# Altium schematic sheet Transmissor Ignitor.SchDoc
size A4
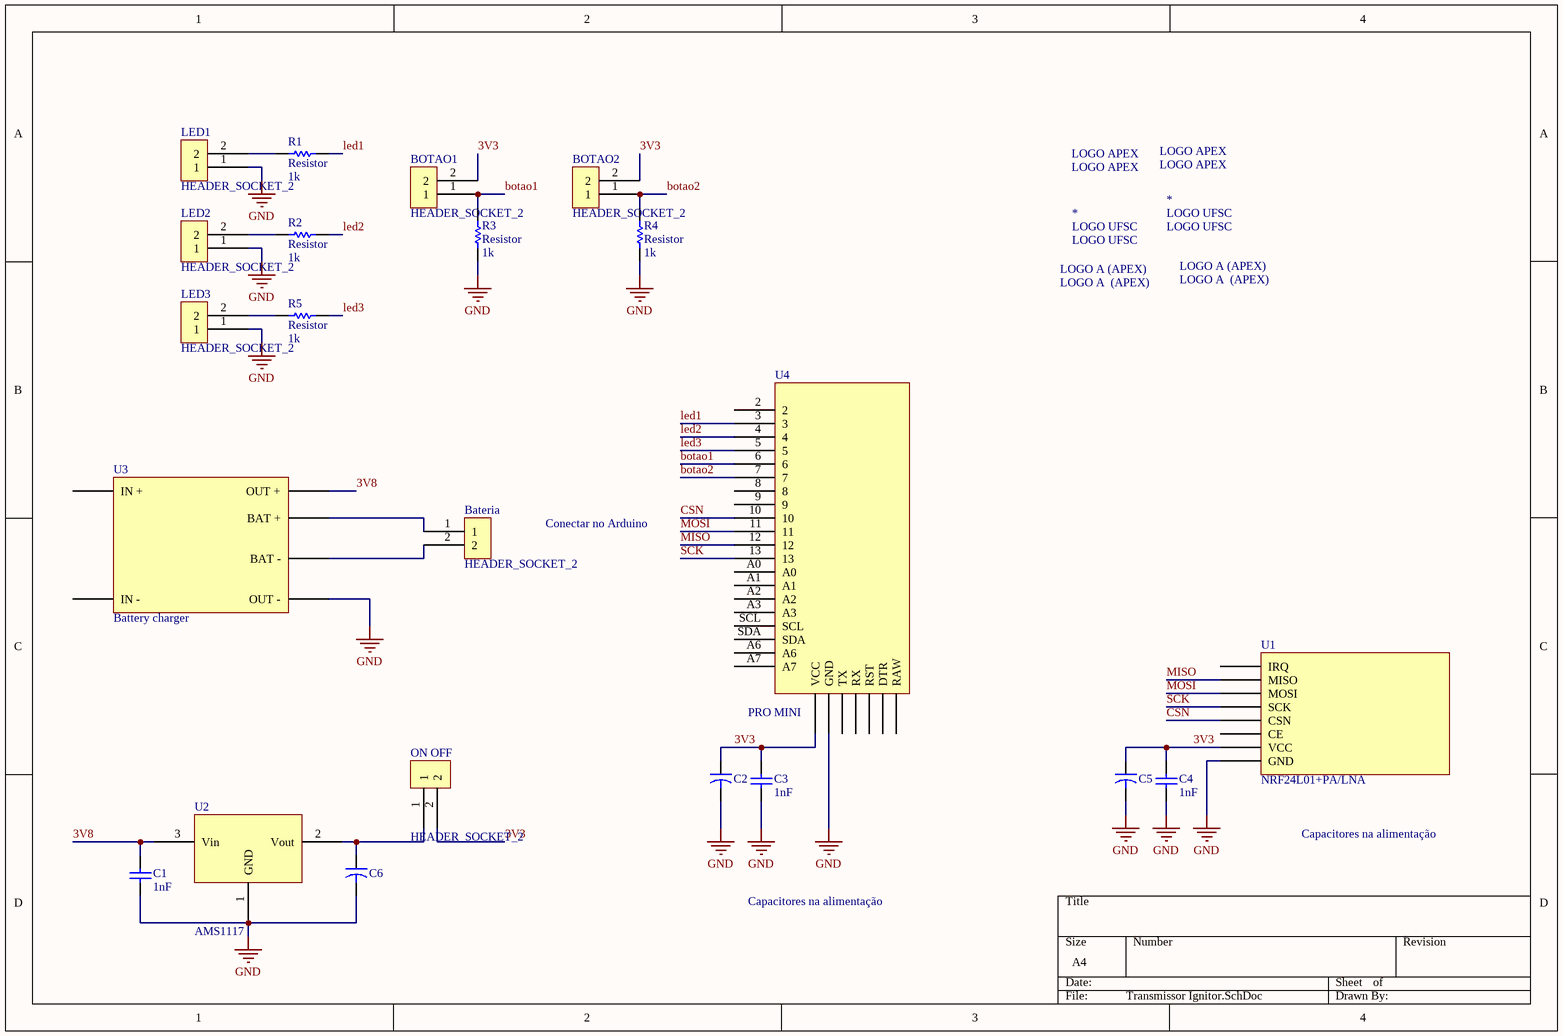
[diagram p0: Transmissor Ignitor.SchDoc]

## Parts
(Parts that share a designator on the sheet are numbered #1, #2 ... from top to bottom, then left to right.)
*1  LOGO APEX  [Logo Apex]
*2  LOGO APEX  [Logo Apex]
*5  LOGO A  (APEX)  [LOGO A (apex)]
*6  LOGO A  (APEX)  [LOGO A (apex)]
*#1  LOGO UFSC  [LOGO UFSC]
*#2  LOGO UFSC  [LOGO UFSC]
Bateria  HEADER_SOCKET_2  [Pin Header 1x2 TH Pitch 2.54mm]
BOTAO1  HEADER_SOCKET_2  [Pin Header 1x2 TH Pitch 2.54mm]
BOTAO2  HEADER_SOCKET_2  [Pin Header 1x2 TH Pitch 2.54mm]
C1  value 1nF  [CAP0805R]  (hidden comment: Cap_ceramic)
C2  CAP_ELEC  [CAPPR250-63X11]  (value not drawn)
C3  value 1nF  [CAP0805R]  (hidden comment: Cap_ceramic)
C4  value 1nF  [CAP0805R]  (hidden comment: Cap_ceramic)
C5  CAP_ELEC  [CAPPR250-63X11]  (value not drawn)
C6  CAP_ELEC  [CAPPR250-63X11]  (value not drawn)
LED1  HEADER_SOCKET_2  [Pin Header 1x2 TH Pitch 2.54mm]
LED2  HEADER_SOCKET_2  [Pin Header 1x2 TH Pitch 2.54mm]
LED3  HEADER_SOCKET_2  [Pin Header 1x2 TH Pitch 2.54mm]
ON_OFF  HEADER_SOCKET_2  [Pin Header 1x2 TH Pitch 2.54mm]
R1  Resistor  value 1k  [RES0805R]
R2  Resistor  value 1k  [RES0805R]
R3  Resistor  value 1k  [RES0805R]
R4  Resistor  value 1k  [RES0805R]
R5  Resistor  value 1k  [RES0805R]
U1  NRF24L01+PA/LNA  [NRF24L01]
U2  AMS1117  [SOT-223-2]
U3  Battery charger  [Battery charger]
U4  PRO MINI  [Pro mini]

## Nets
GND: C1.1 C2.2 C3.1 C4.1 C5.2 C6.2 LED1.1 LED2.1 LED3.1 R3.1 R4.1 U1.1(GND) U2.1(GND) U3.OUT_- U4.GND
3V3: BOTAO1.2 BOTAO2.2 C2.1 C3.2 C4.2 C5.1 ON_OFF.2 U1.2(VCC) U4.VCC
3V8: C1.2 U2.3(Vin) U3.OUT_+
botao1: BOTAO1.1 R3.2 U4.6
botao2: BOTAO2.1 R4.2 U4.7
CSN: U1.4(CSN) U4.10
led1: R1.2 U4.3
led2: R2.2 U4.4
led3: R5.2 U4.5
MISO: U1.7(MISO) U4.12
MOSI: U1.6(MOSI) U4.11
SCK: U1.5(SCK) U4.13
NetBateria_1: Bateria.1 U3.BAT_+
NetBateria_2: Bateria.2 U3.BAT_-
NetC6_1: C6.1 ON_OFF.1 U2.2(Vout)
NetLED1_2: LED1.2 R1.1
NetLED2_2: LED2.2 R2.1
NetLED3_2: LED3.2 R5.1

Not connected (* = marked no-connect by the designer): U1 3(CE) 8(IRQ); U3 IN + IN -; U4 2 8 9 A0 A1 A2 A3 A6 A7 DTR RAW RST RX SCL SDA TX

## Notes on the sheet
- Conectar no Arduino
- Capacitores na alimentação
- (in symbol LOGO A  (APEX)) LOGO A (APEX)

## Library data of the parts
Bateria BOTAO1 BOTAO2 LED1-LED3 ON_OFF = HEADER_SOCKET_2: Socket to header connector with 2 pins
C1 C3 C4 = Cap_ceramic: Capacitor; Published: 8-Jun-2000; LatestRevisionDate: 17-Jul-2002; LatestRevisionNote: Re-released for DXP Platform.; PackageReference: RAD-0.3; Publisher: Altium Limited; PackageDescription: Radial Cap, Thru-Hole; 2 Leads; 0.3 in Pin Spacing
C2 C5 C6 = CAP_ELEC: Capacitor; Published: 23-Sep-2002; PackageReference: CAPR5-4X5; Publisher: Altium Limited; PackageDescription: Capacitor; 2 Leads
R1-R5 = Resistor: Published: 8-Jun-2000; LatestRevisionDate: 17-Jul-2002; LatestRevisionNote: Re-released for DXP Platform.; PackageReference: AXIAL-0.3; Publisher: Altium Limited; PackageDescription: Axial Device, Thru-Hole; 2 Leads; 0.3 in Pin Spacing